# EasyEDA schematic SCH_RE2-YM2608-REV.0.6_2024-08-25.json

## Sheets
1 OPNA: TITLE: Sheet_1; REV: 1.0; Date: 2023-12-15; Sheet: 1/1; Drawn By: Denjhang; Company: Your Company
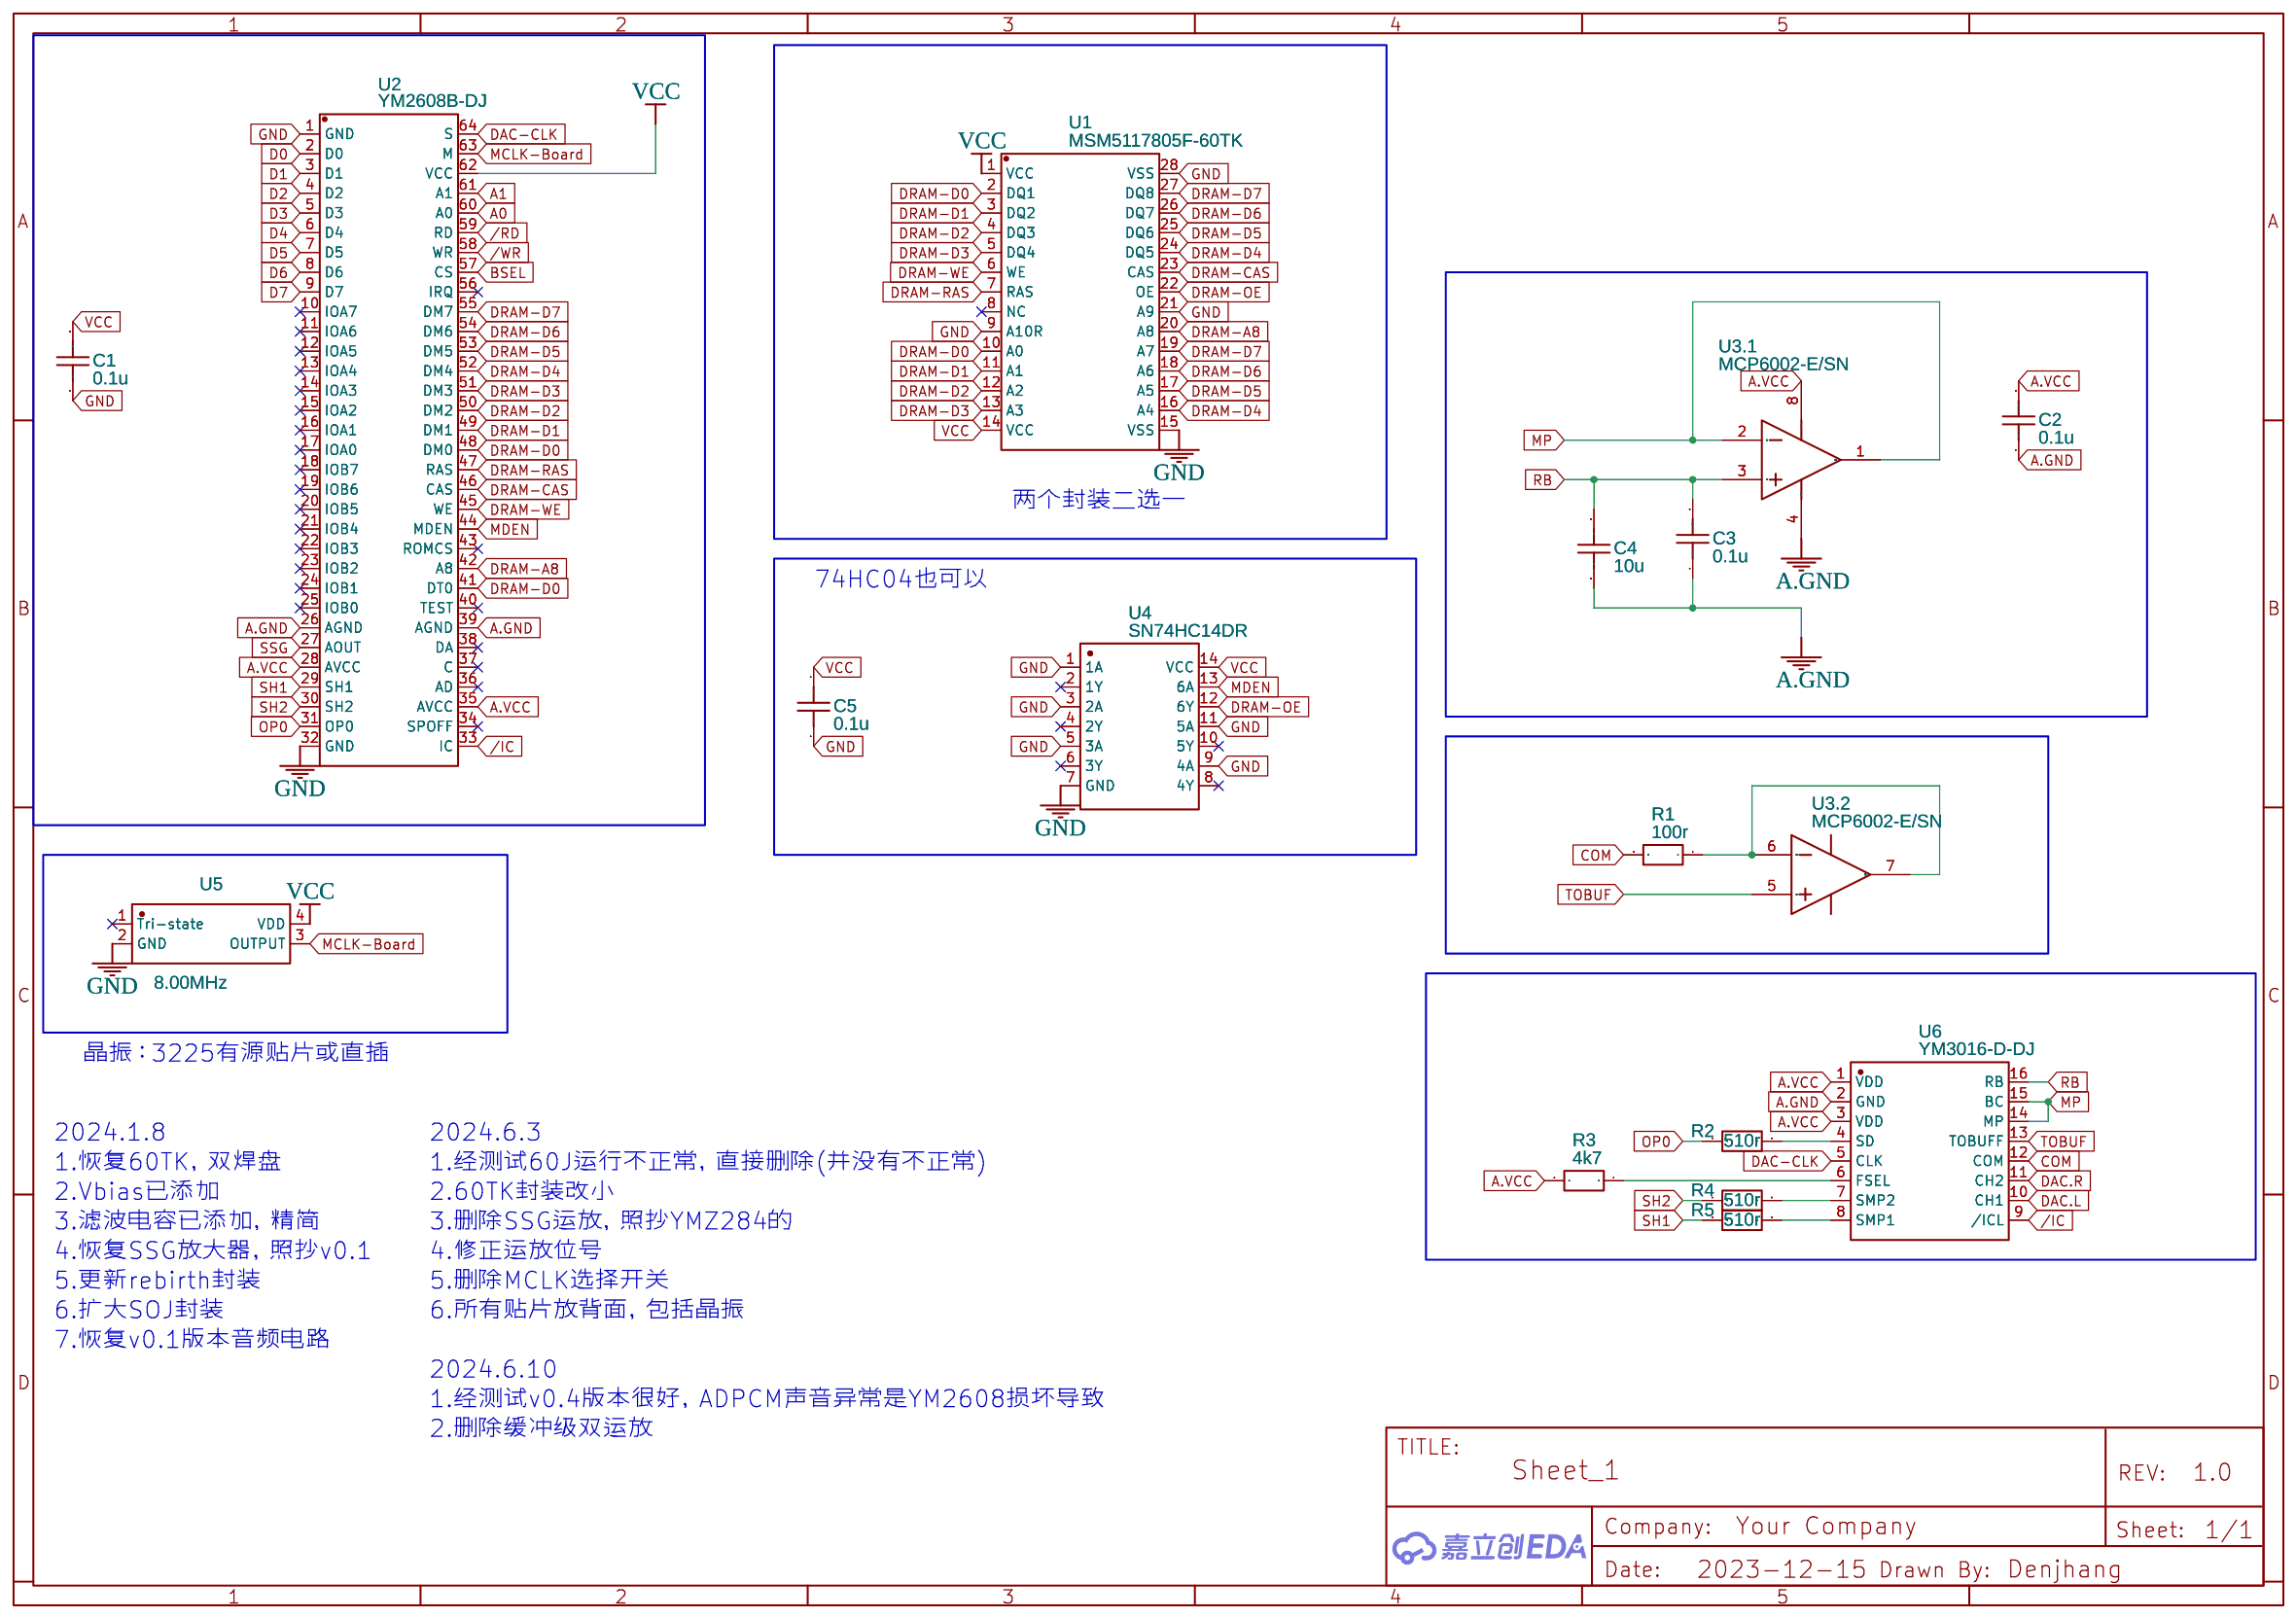
[diagram p0: OPNA]
2 BUS-PSU: TITLE: Sheet_2
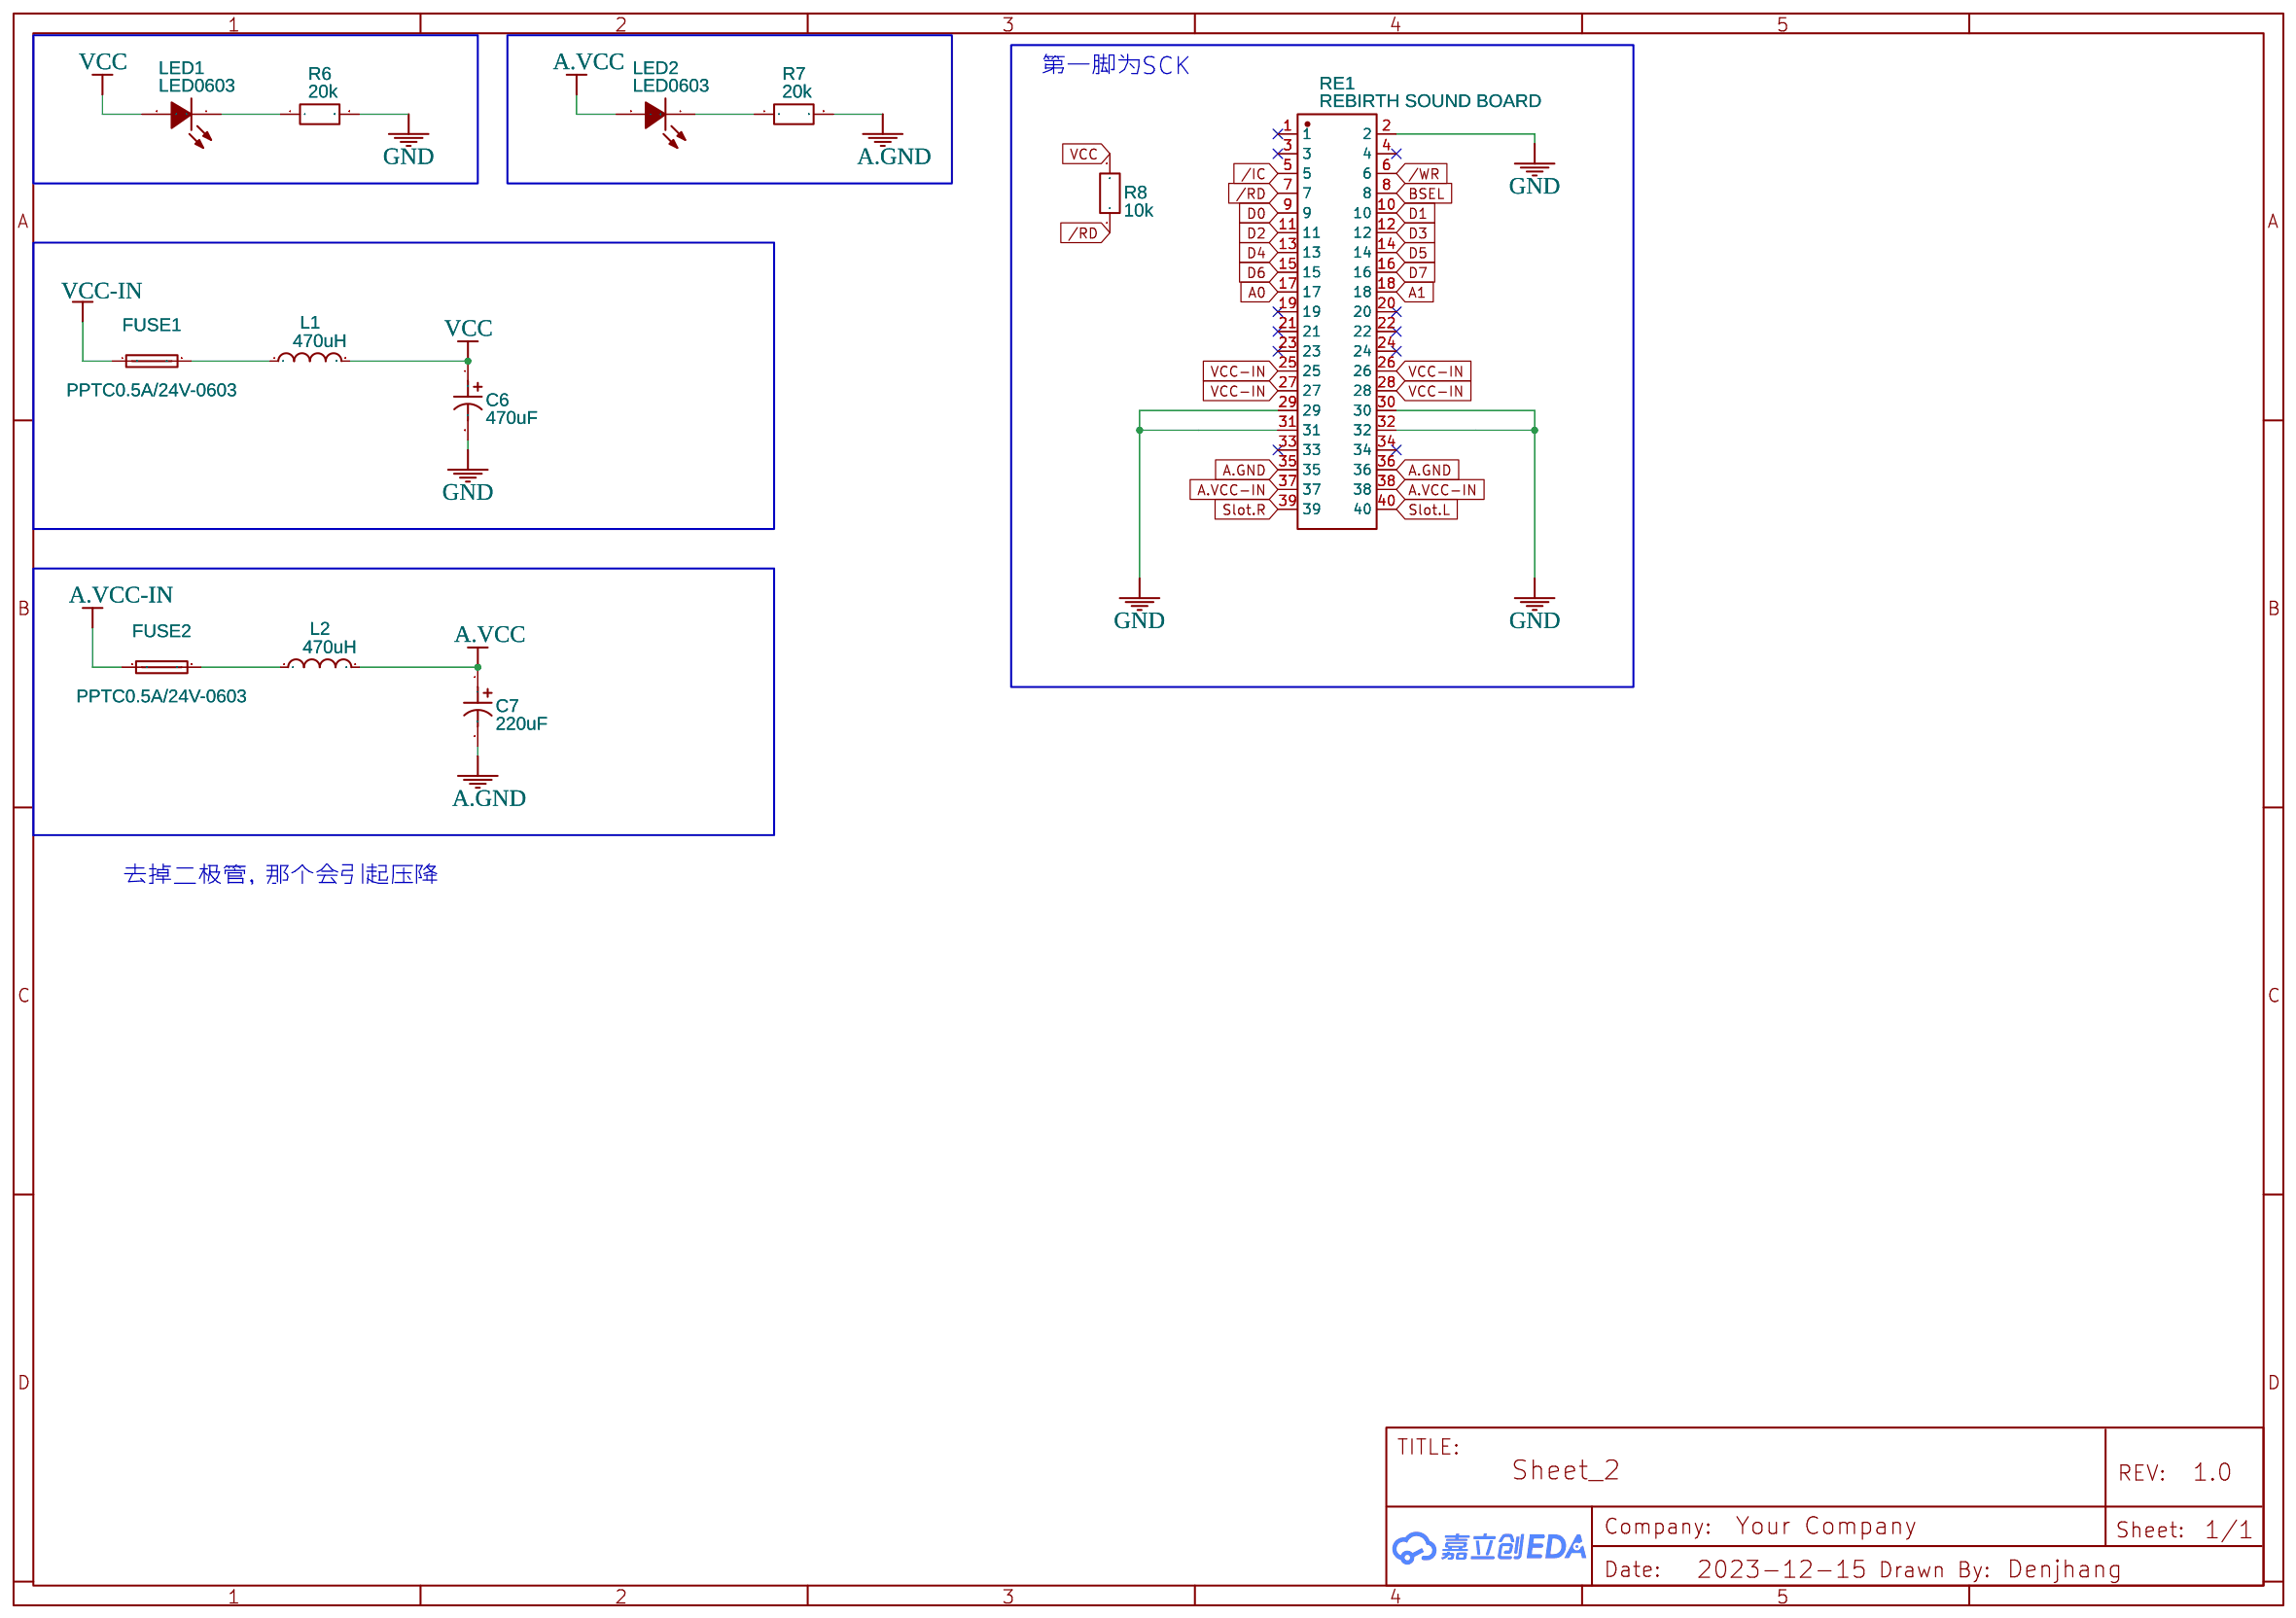
[diagram p1: BUS-PSU]
3 AMP-FM
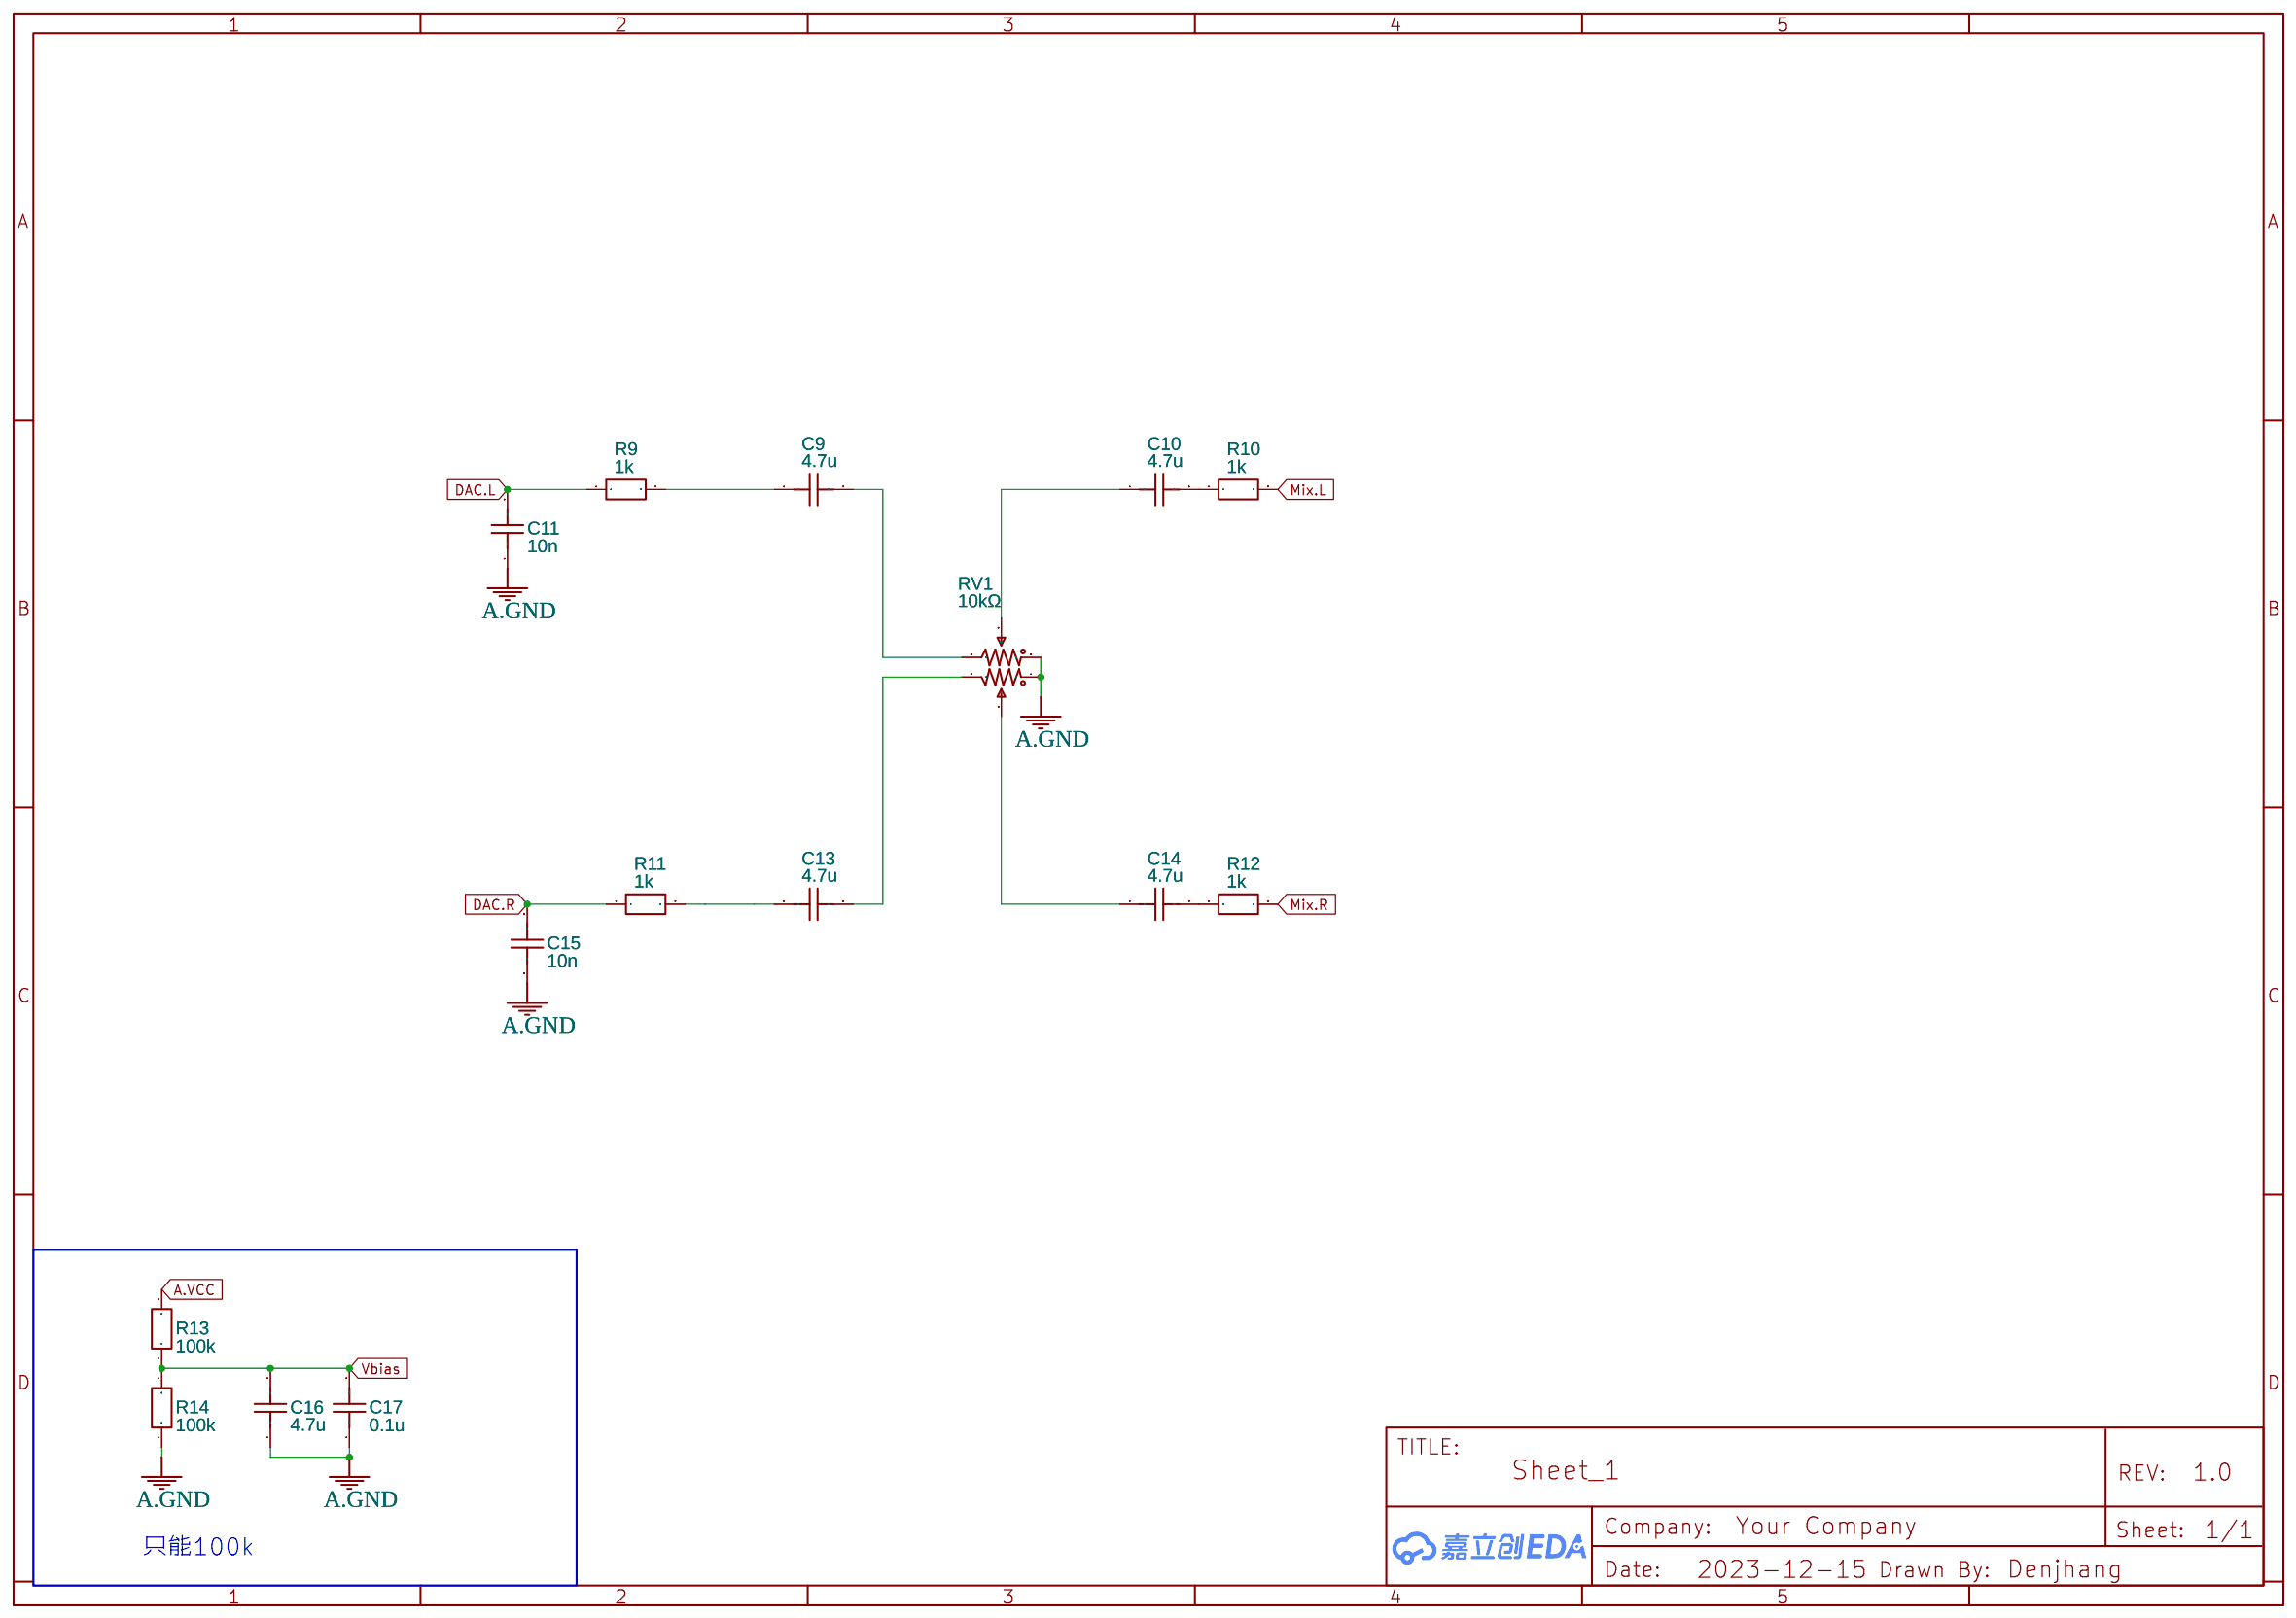
[diagram p2: AMP-FM]
4 AMP-SSG
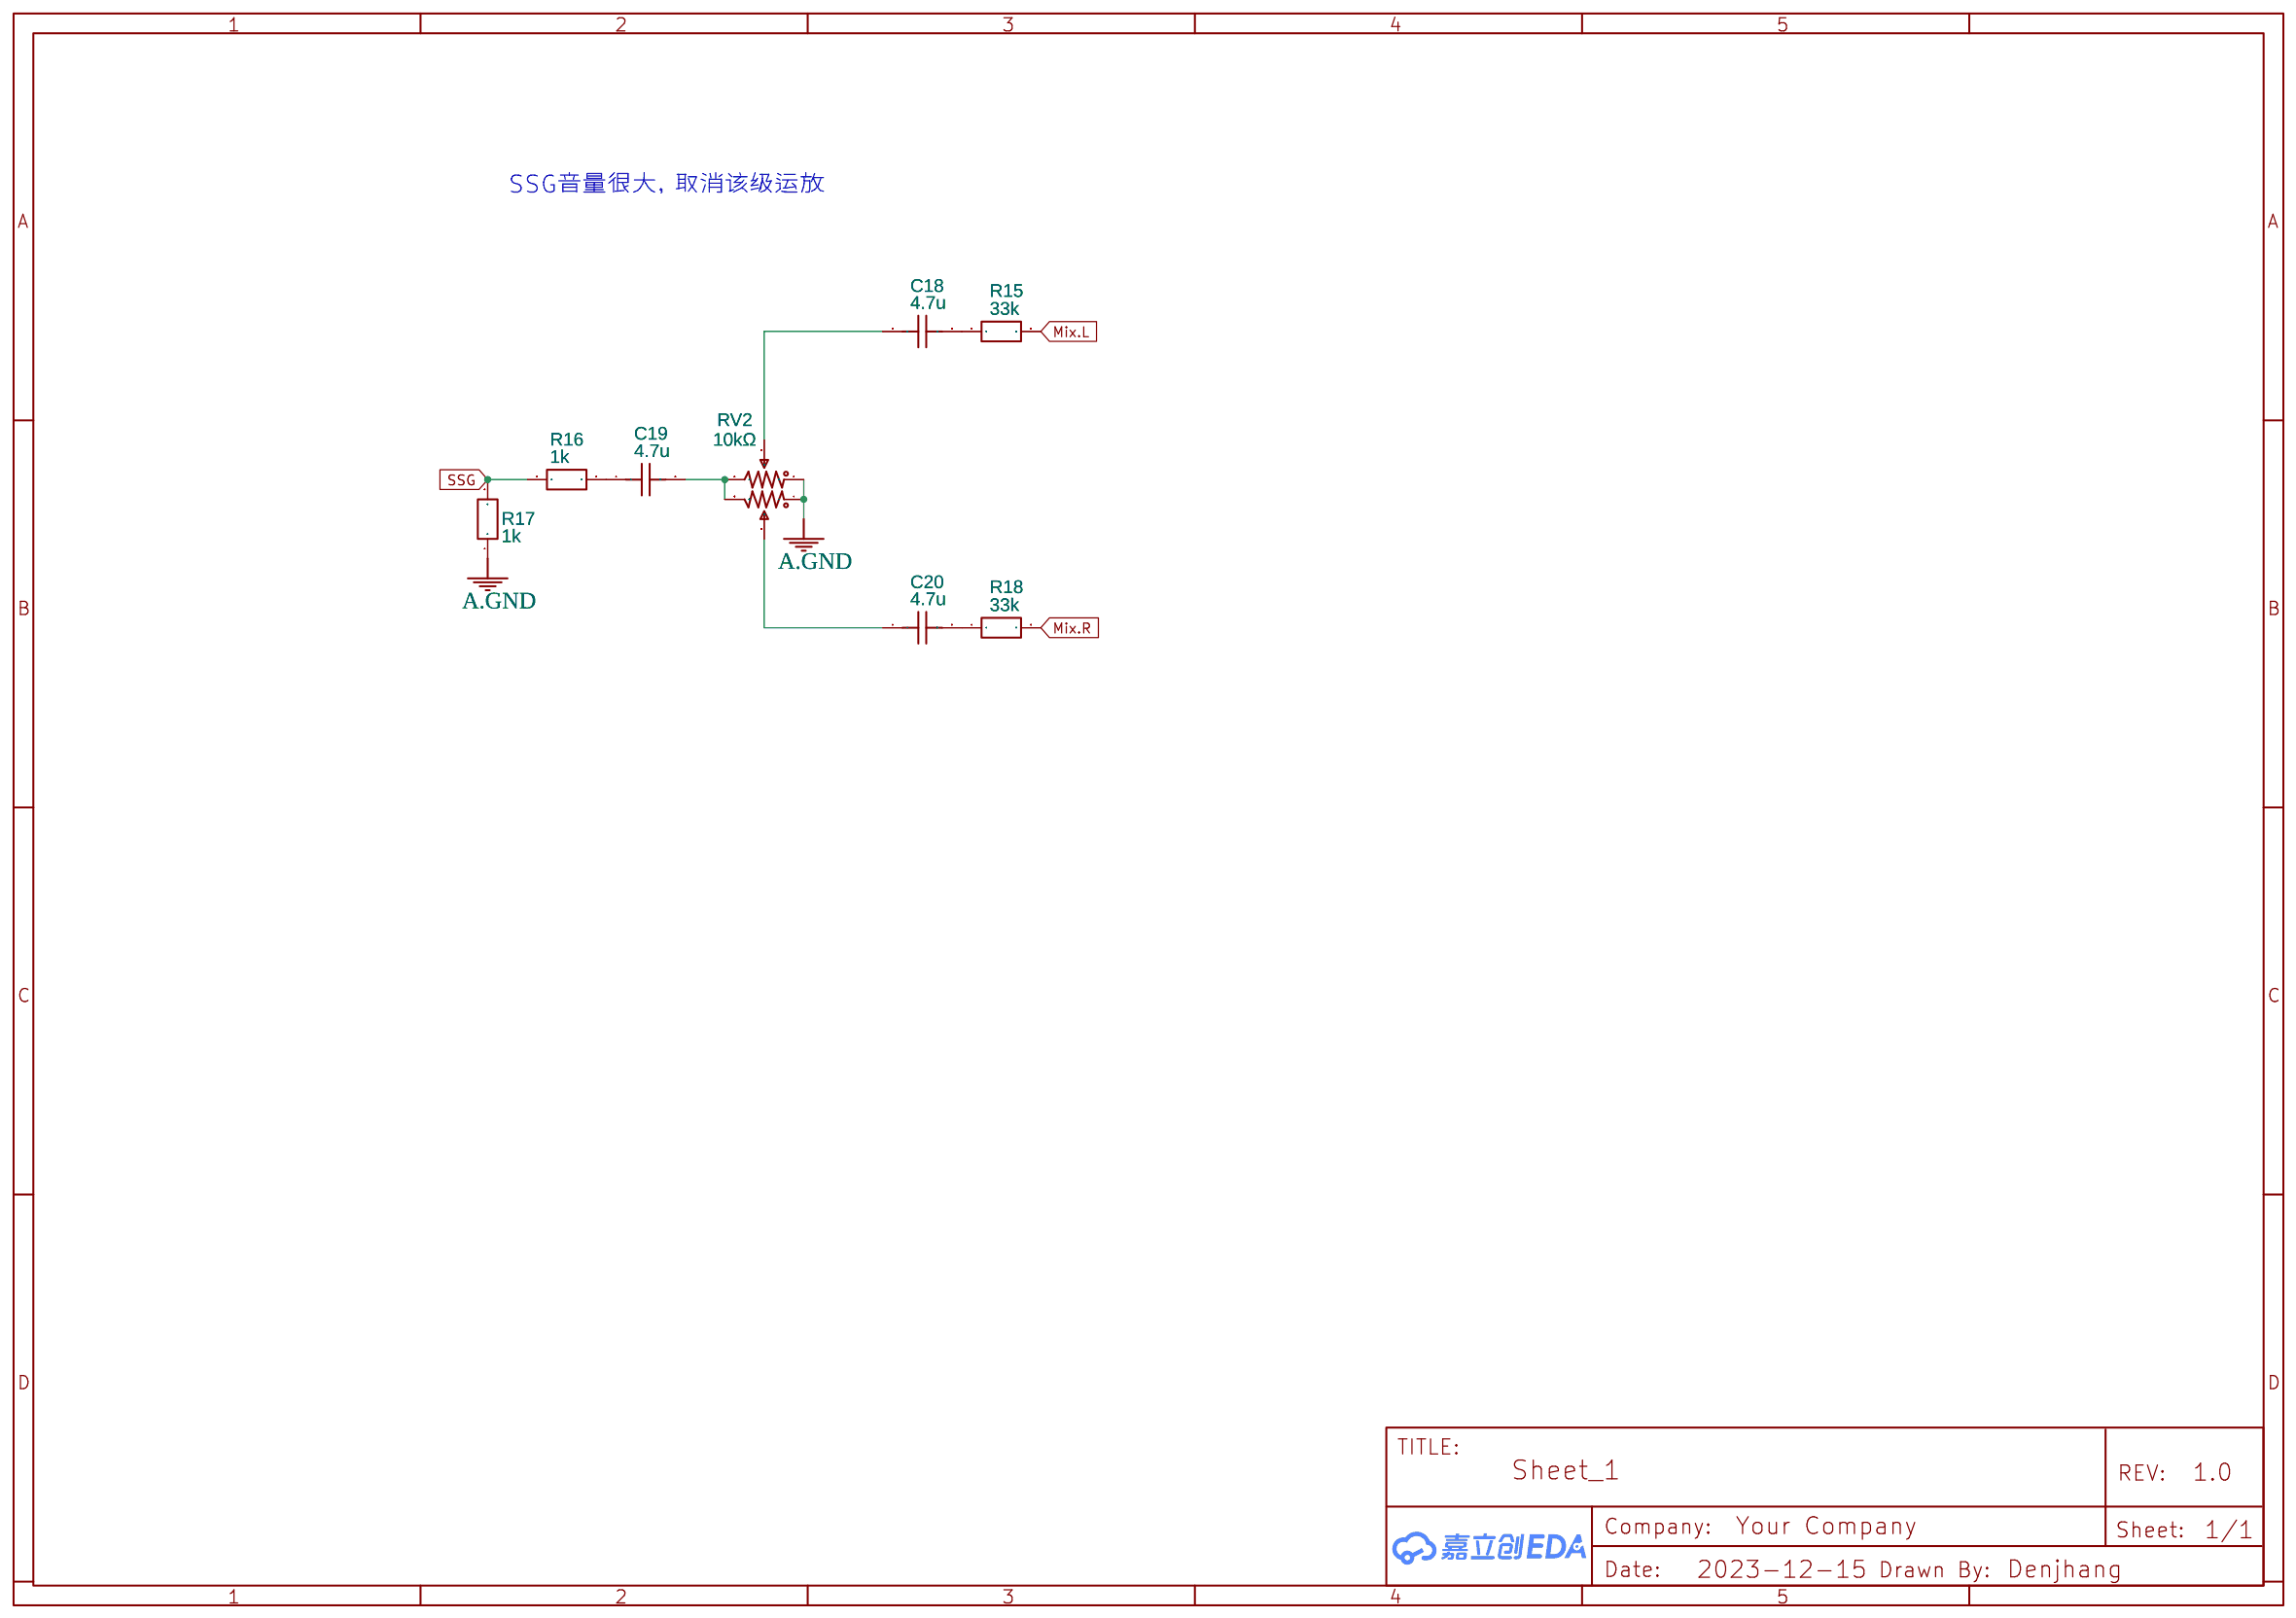
[diagram p3: AMP-SSG]
5 Mixer
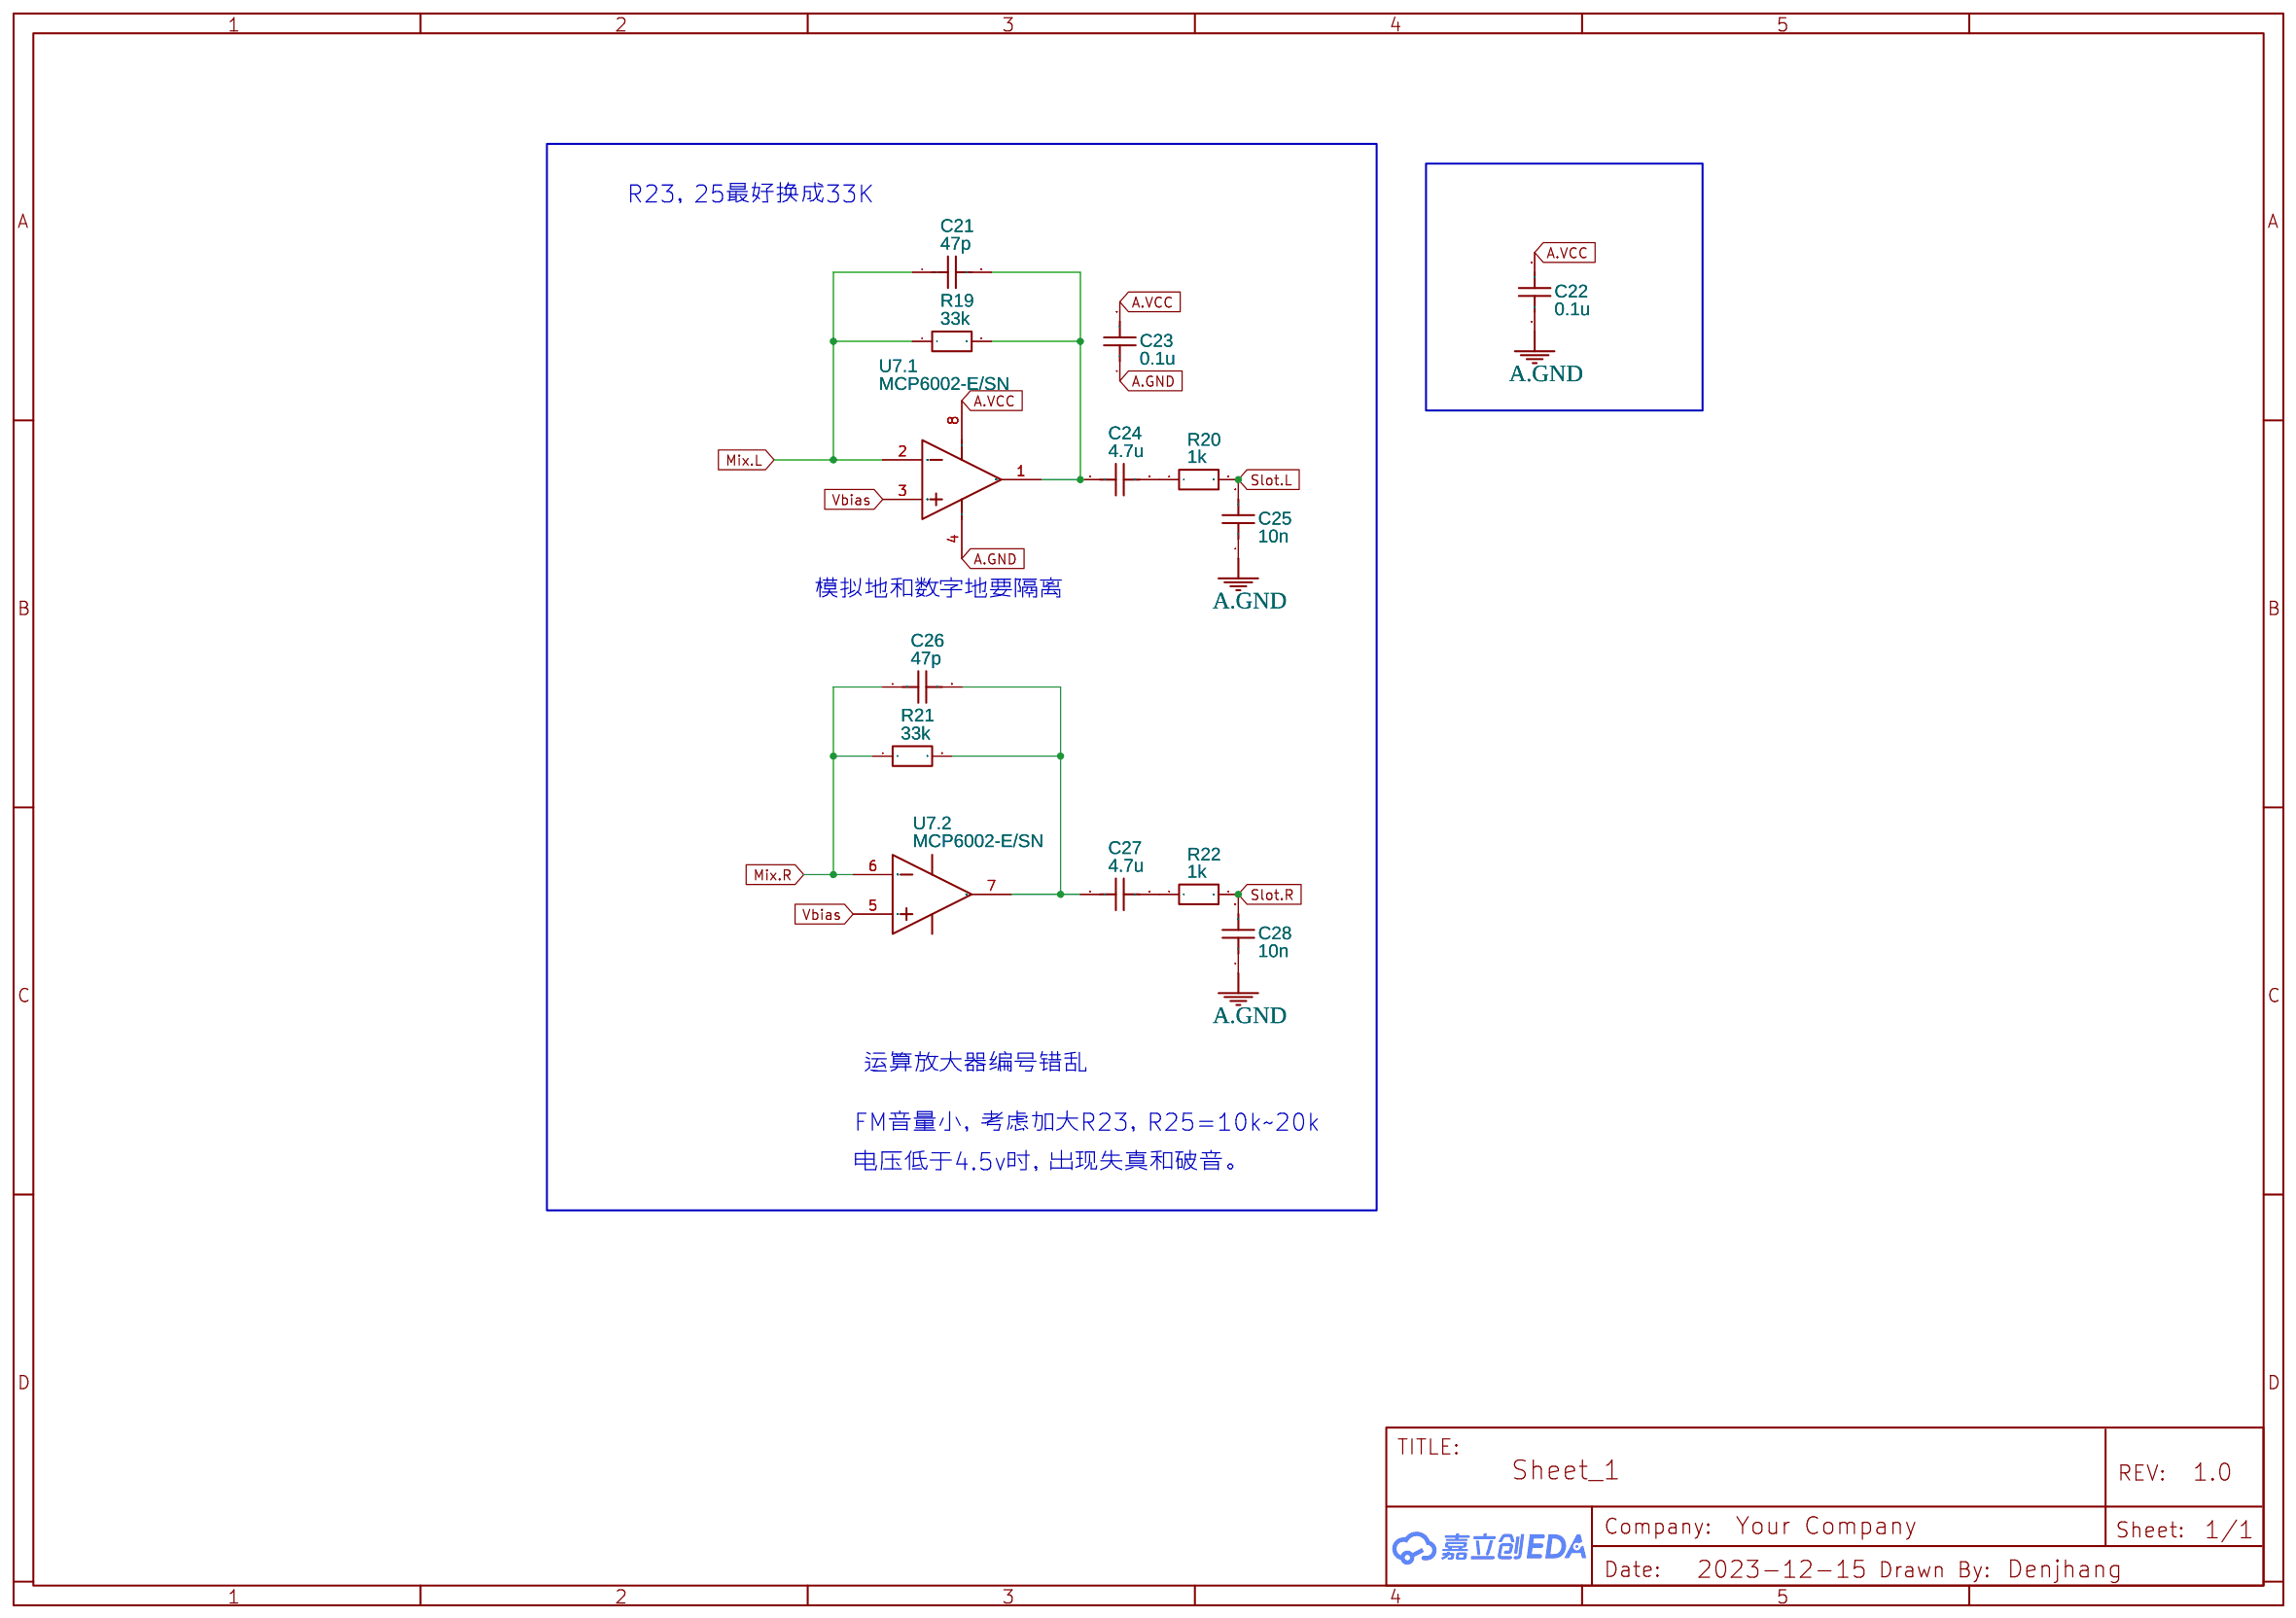
[diagram p4: Mixer]

## Parts
sheet AMP-FM
C9  4.7u  [C0603]
C10  4.7u  [C0603]
C11  10n  [C0603]
C13  4.7u  [C0603]
C14  4.7u  [C0603]
C15  10n  [C0603]
C16  4.7u  [C0805]
C17  0.1u  [C0603]
R9  1k  [R0603]
R10  1k  [R0603]
R11  1k  [R0603]
R12  1k  [R0603]
R13  100k  [R0603]
R14  100k  [R0603]
RV1  10kΩ  [RK097G-DJ]
sheet AMP-SSG
C18  4.7u  [C0603]
C19  4.7u  [C0603]
C20  4.7u  [C0603]
R15  33k  [R0603]
R16  1k  [R0603]
R17  1k  [R0603]
R18  33k  [R0603]
RV2  10kΩ  [RK097G-DJ]
sheet BUS-PSU
C6  470uF  [CAP-SMD_BD6.3-L6.6-W6.6-FD]
C7  220uF  [CAP-SMD_BD6.3-L6.6-W6.6-LS7.2-FD]
FUSE1  PPTC0.5A/24V-0603  [F0603]
FUSE2  PPTC0.5A/24V-0603  [F0603]
L1  470uH  [IND-SMD_L5.8-W5.2]
L2  470uH  [IND-SMD_L5.8-W5.2]
LED1  LED0603  [LED0603-RD]
LED2  LED0603  [LED0603-RD]
R6  20k  [R0603]
R7  20k  [R0603]
R8  10k  [R0603]
RE1  REBIRTH SOUND BOARD  [REBIRTH SOUND BOARD]
sheet Mixer
C21  47p  [C0603]
C22  0.1u  [C0603]
C23  0.1u  [C0603]
C24  4.7u  [C0805]
C25  10n  [C0603]
C26  47p  [C0603]
C27  4.7u  [C0805]
C28  10n  [C0603]
R19  33k  [R0603]
R20  1k  [R0603]
R21  33k  [R0603]
R22  1k  [R0603]
U7  MCP6002-E/SN  [SOIC-8_L5.0-W4.0-P1.27-LS6.0-BL]  (sections 1,2)
sheet OPNA
C1  0.1u  [C0603]
C2  0.1u  [C0603]
C3  0.1u  [C0603]
C4  10u  [C0805]
C5  0.1u  [C0603]
R1  100r  [R0603]
R2  510r  [R0603]
R3  4k7  [R0603]
R4  510r  [R0603]
R5  510r  [R0603]
U1  MSM5117805F-60TK  [TSOP28-M5117805F-60TK]
U2  YM2608B-DJ  [SDIP64-DJ]
U3  MCP6002-E/SN  [SOIC-8_L5.0-W4.0-P1.27-LS6.0-BL]  (sections 1,2)
U4  SN74HC14DR  [SOIC-14_L8.7-W3.9-P1.27-LS6.0-BL]
U5  8.00MHz  [OSC-SMD_4P-L3.2-W2.5-BL]
U6  YM3016-D-DJ  [DIP16-DJ]

## Library data of the parts
C1-C3 C5 C9-C11 C13-C15 C17-C23 C25 C26 C28 = C_0603_US: Contributor: LCEDA_Lib
C4 C16 C24 C27 = C_0805_US: Contributor: LCEDA_Lib
R1-R22 = R_0603_EU: Contributor: LCEDA_Lib
RV1 RV2 = RK097-双连体: Contributor: LCSC; Supplier: LCSC; Supplier Part: C231763; Manufacturer: ALPSALPINE(阿尔卑斯阿尔派); Manufacturer Part: RK09712200MY; JLCPCB Part Class: Extended Part
C6 = RVT220UF16V67RV0015: Contributor: LCSC; Supplier: LCSC; Supplier Part: C2887273; Manufacturer: KNSCHA(科尼盛); JLCPCB Part Class: Extended Part; link: https://so.szlcsc.com/global.html?k=C2887273&ref=editor
C7 = RVT47UF35V67RV0039: Contributor: LCSC; Supplier: LCSC; Supplier Part: C2836440; Manufacturer: KNSCHA(科尼盛); JLCPCB Part Class: Extended Part; link: https://so.szlcsc.com/global.html?k=C2836440&ref=editor
FUSE1 FUSE2 = PPTC0.5A/24V-0603: Contributor: LCSC; Supplier: LCSC; Supplier Part: C9900007586; Manufacturer: null; Manufacturer Part: PPTC0.5A/24V 自恢复保险丝-0603; JLCPCB Part Class: Extended Part
L1 L2 = MSCD54-471KT: Contributor: LCSC; Supplier: LCSC; Supplier Part: C915206; Manufacturer: Meled(美莱); JLCPCB Part Class: Extended Part; link: https://so.szlcsc.com/global.html?k=C915206&ref=editor
LED1 LED2 = LED0603: Supplier: LCSC; Supplier Part: C2892154; Manufacturer: GBG; Manufacturer Part: GBG-C192KRKT; link: https://atta.szlcsc.comnull; Contributor: Denjhang
RE1 = REBIRTH SOUND BOARD: Contributor: lcsc; Supplier: LCSC; Supplier Part: C5242133; Manufacturer: XKB Connectivity(中国星坤); Manufacturer Part: X6522WR-2x20H-C60D30-E43F03
U3 U7 = MCP6002-E/SN: subpart_no: 1; Supplier: LCSC; Supplier Part: C636235; Manufacturer: MICROCHIP(美国微芯); JLCPCB Part Class: Extended Part
U1 = MSM5117805F-60TK: Contributor: lizaer012
U2 = YM2608B-DJ: Manufacturer Part: YAMAHA; Contributor: ZengRunMing
U4 = SN74HC14DR: Supplier: LCSC; Manufacturer: TI(德州仪器); Supplier Part: C6820; JLCPCB Part Class: Extended Part; link: https://so.szlcsc.com/global.html?k=C6820&ref=editor
U5 = OT32254MJBA4SL: Contributor: lcsc; Supplier: LCSC; Supplier Part: C2831397; Manufacturer: YXC(扬兴晶振); JLCPCB Part Class: Extended Part; link: https://so.szlcsc.com/global.html?k=C2831397&ref=editor
U6 = YM3016-D-DJ: Contributor: 74644323

## Nets
GND: C1.1 C5.1 C6.2 R6.2 RE1.2 RE1.29 RE1.30 RE1.31 RE1.32 U1.9(A10R) U1.15(VSS) U1.21(A9) U1.28(VSS) U2.1(GND) U2.32(GND) U4.1(1A) U4.3(2A) U4.5(3A) U4.7(GND) U4.9(4A) U4.11(5A) U5.2(GND)
VCC: C1.2 C5.2 C6.1 L1.2 LED1.2(A) R8.2 U1.1(VCC) U1.14(VCC) U2.62(VCC) U4.14(VCC) U5.4(VDD)
VCC-IN: FUSE1.1 RE1.25 RE1.26 RE1.27 RE1.28
/IC: RE1.5 U2.33(IC) U6.9(/ICL)
/RD: R8.1 RE1.7 U2.59(RD)
/WR: RE1.6 U2.58(WR)
A0: RE1.17 U2.60(A0)
A1: RE1.18 U2.61(A1)
A.GND: C2.1 C3.1 C4.2 C7.2 C11.1 C15.1 C16.1 C17.1 C22.1 C23.1 C25.1 C28.1 R7.2 R14.1 R17.1 RE1.35 RE1.36 RV1.1 RV1.4 RV2.1 RV2.4 U2.26(AGND) U2.39(AGND) U3.4(VSS) U6.2(GND) U7.4(VSS)
A.VCC: C2.2 C7.1 C22.2 C23.2 L2.2 LED2.2(A) R3.2 R13.2 U2.28(AVCC) U2.35(AVCC) U3.8(VDD) U6.1(VDD) U6.3(VDD) U7.8(VDD)
A.VCC-IN: FUSE2.1 RE1.37 RE1.38
BSEL: RE1.8 U2.57(CS)
COM: R1.2 U6.12(COM)
D0: RE1.9 U2.2(D0)
D1: RE1.10 U2.3(D1)
D2: RE1.11 U2.4(D2)
D3: RE1.12 U2.5(D3)
D4: RE1.13 U2.6(D4)
D5: RE1.14 U2.7(D5)
D6: RE1.15 U2.8(D6)
D7: RE1.16 U2.9(D7)
DAC-CLK: U2.64(S) U6.5(CLK)
DAC.L: C11.2 R9.1 U6.10(CH1)
DAC.R: C15.2 R11.1 U6.11(CH2)
DRAM-A8: U1.20(A8) U2.42(A8)
DRAM-CAS: U1.23(CAS) U2.46(CAS)
DRAM-D0: U1.2(DQ1) U1.10(A0) U2.41(DT0) U2.48(DM0)
DRAM-D1: U1.3(DQ2) U1.11(A1) U2.49(DM1)
DRAM-D2: U1.4(DQ3) U1.12(A2) U2.50(DM2)
DRAM-D3: U1.5(DQ4) U1.13(A3) U2.51(DM3)
DRAM-D4: U1.16(A4) U1.24(DQ5) U2.52(DM4)
DRAM-D5: U1.17(A5) U1.25(DQ6) U2.53(DM5)
DRAM-D6: U1.18(A6) U1.26(DQ7) U2.54(DM6)
DRAM-D7: U1.19(A7) U1.27(DQ8) U2.55(DM7)
DRAM-OE: U1.22(OE) U4.12(6Y)
DRAM-RAS: U1.7(RAS) U2.47(RAS)
DRAM-WE: U1.6(WE) U2.45(WE)
MCLK-Board: U2.63(M) U5.3(OUTPUT)
MDEN: U2.44(MDEN) U4.13(6A)
Mix.L: C21.1 R10.2 R15.2 R19.1 U7.2(VINA-)
Mix.R: C26.1 R12.2 R18.2 R21.1 U7.6(VINB-)
MP: U3.1(VOUTA) U3.2(VINA-) U6.14(MP) U6.15(BC)
OP0: R2.1 U2.31(OP0)
RB: C3.2 C4.1 U3.3(VINA+) U6.16(RB)
SH1: R5.1 U2.29(SH1)
SH2: R4.1 U2.30(SH2)
Slot.L: C25.2 R20.2 RE1.40
Slot.R: C28.2 R22.2 RE1.39
SSG: R16.2 R17.2 U2.27(AOUT)
TOBUF: U3.5(VINB+) U6.13(TOBUFF)
Vbias: C16.2 C17.2 R13.1 R14.2 U7.3(VINA+) U7.5(VINB+)
Net-(C9-1): C9.1 R9.2
Net-(C9-2): C9.2 RV1.3
Net-(C10-1): C10.1 RV1.2
Net-(C10-2): C10.2 R10.1
Net-(C13-1): C13.1 R11.2
Net-(C13-2): C13.2 RV1.6
Net-(C14-1): C14.1 RV1.5
Net-(C14-2): C14.2 R12.1
Net-(C18-1): C18.1 RV2.2
Net-(C18-2): C18.2 R15.1
Net-(C19-1): C19.1 R16.1
Net-(C19-2): C19.2 RV2.3 RV2.6
Net-(C20-1): C20.1 RV2.5
Net-(C20-2): C20.2 R18.1
Net-(C21-2): C21.2 C24.1 R19.2 U7.1(VOUTA)
Net-(C24-2): C24.2 R20.1
Net-(C26-2): C26.2 C27.1 R21.2 U7.7(VOUTB)
Net-(C27-2): C27.2 R22.1
Net-(FUSE1-2): FUSE1.2 L1.1
Net-(FUSE2-2): FUSE2.2 L2.1
Net-(LED1-1): LED1.1(C) R6.1
Net-(LED2-1): LED2.1(C) R7.1
Net-(R1-1): R1.1 U3.6(VINB-) U3.7(VOUTB)
Net-(R2-2): R2.2 U6.4(SD)
Net-(R3-1): R3.1 U6.6(FSEL)
Net-(R4-2): R4.2 U6.7(SMP2)
Net-(R5-2): R5.2 U6.8(SMP1)

Not connected (* = marked no-connect by the designer): RE1 1* 3* 4* 19* 20* 21* 22* 23* 24* 33* 34*; U1 8(NC)*; U2 10(IOA7)* 11(IOA6)* 12(IOA5)* 13(IOA4)* 14(IOA3)* 15(IOA2)* 16(IOA1)* 17(IOA0)* 18(IOB7)* 19(IOB6)* 20(IOB5)* 21(IOB4)* 22(IOB3)* 23(IOB2)* 24(IOB1)* 25(IOB0)* 34(SPOFF)* 36(AD)* 37(C)* 38(DA)* 40(TEST)* 43(ROMCS)* 56(IRQ)*; U4 2(1Y)* 4(2Y)* 6(3Y)* 8(4Y)* 10(5Y)*; U5 1(Tri-state)*

## Notes on the sheets
sheet 1
- 两个封装二选一
- 74HC04也可以
- 晶振：3225有源贴片或直插
- 2024.1.8
- 2024.6.3
- 1.恢复60TK，双焊盘
- 1.经测试60J运行不正常，直接删除(并没有不正常)
- 2.Vbias已添加
- 2.60TK封装改小
- 3.滤波电容已添加，精简
- 3.删除SSG运放，照抄YMZ284的
- 4.恢复SSG放大器，照抄v0.1
- 4.修正运放位号
- 5.更新rebirth封装
- 5.删除MCLK选择开关
- 6.扩大SOJ封装
- 6.所有贴片放背面，包括晶振
- 7.恢复v0.1版本音频电路
- 2024.6.10
- 1.经测试v0.4版本很好，ADPCM声音异常是YM2608损坏导致
- 2.删除缓冲级双运放
sheet 2
- 第一脚为SCK
- 去掉二极管，那个会引起压降
sheet 3
- 只能100k
sheet 4
- SSG音量很大，取消该级运放
sheet 5
- R23，25最好换成33K
- 模拟地和数字地要隔离
- 运算放大器编号错乱
- FM音量小，考虑加大R23，R25=10k~20k
- 电压低于4.5v时，出现失真和破音。
